# Altium schematic sheet 10_ethernet100.SchDoc
size C
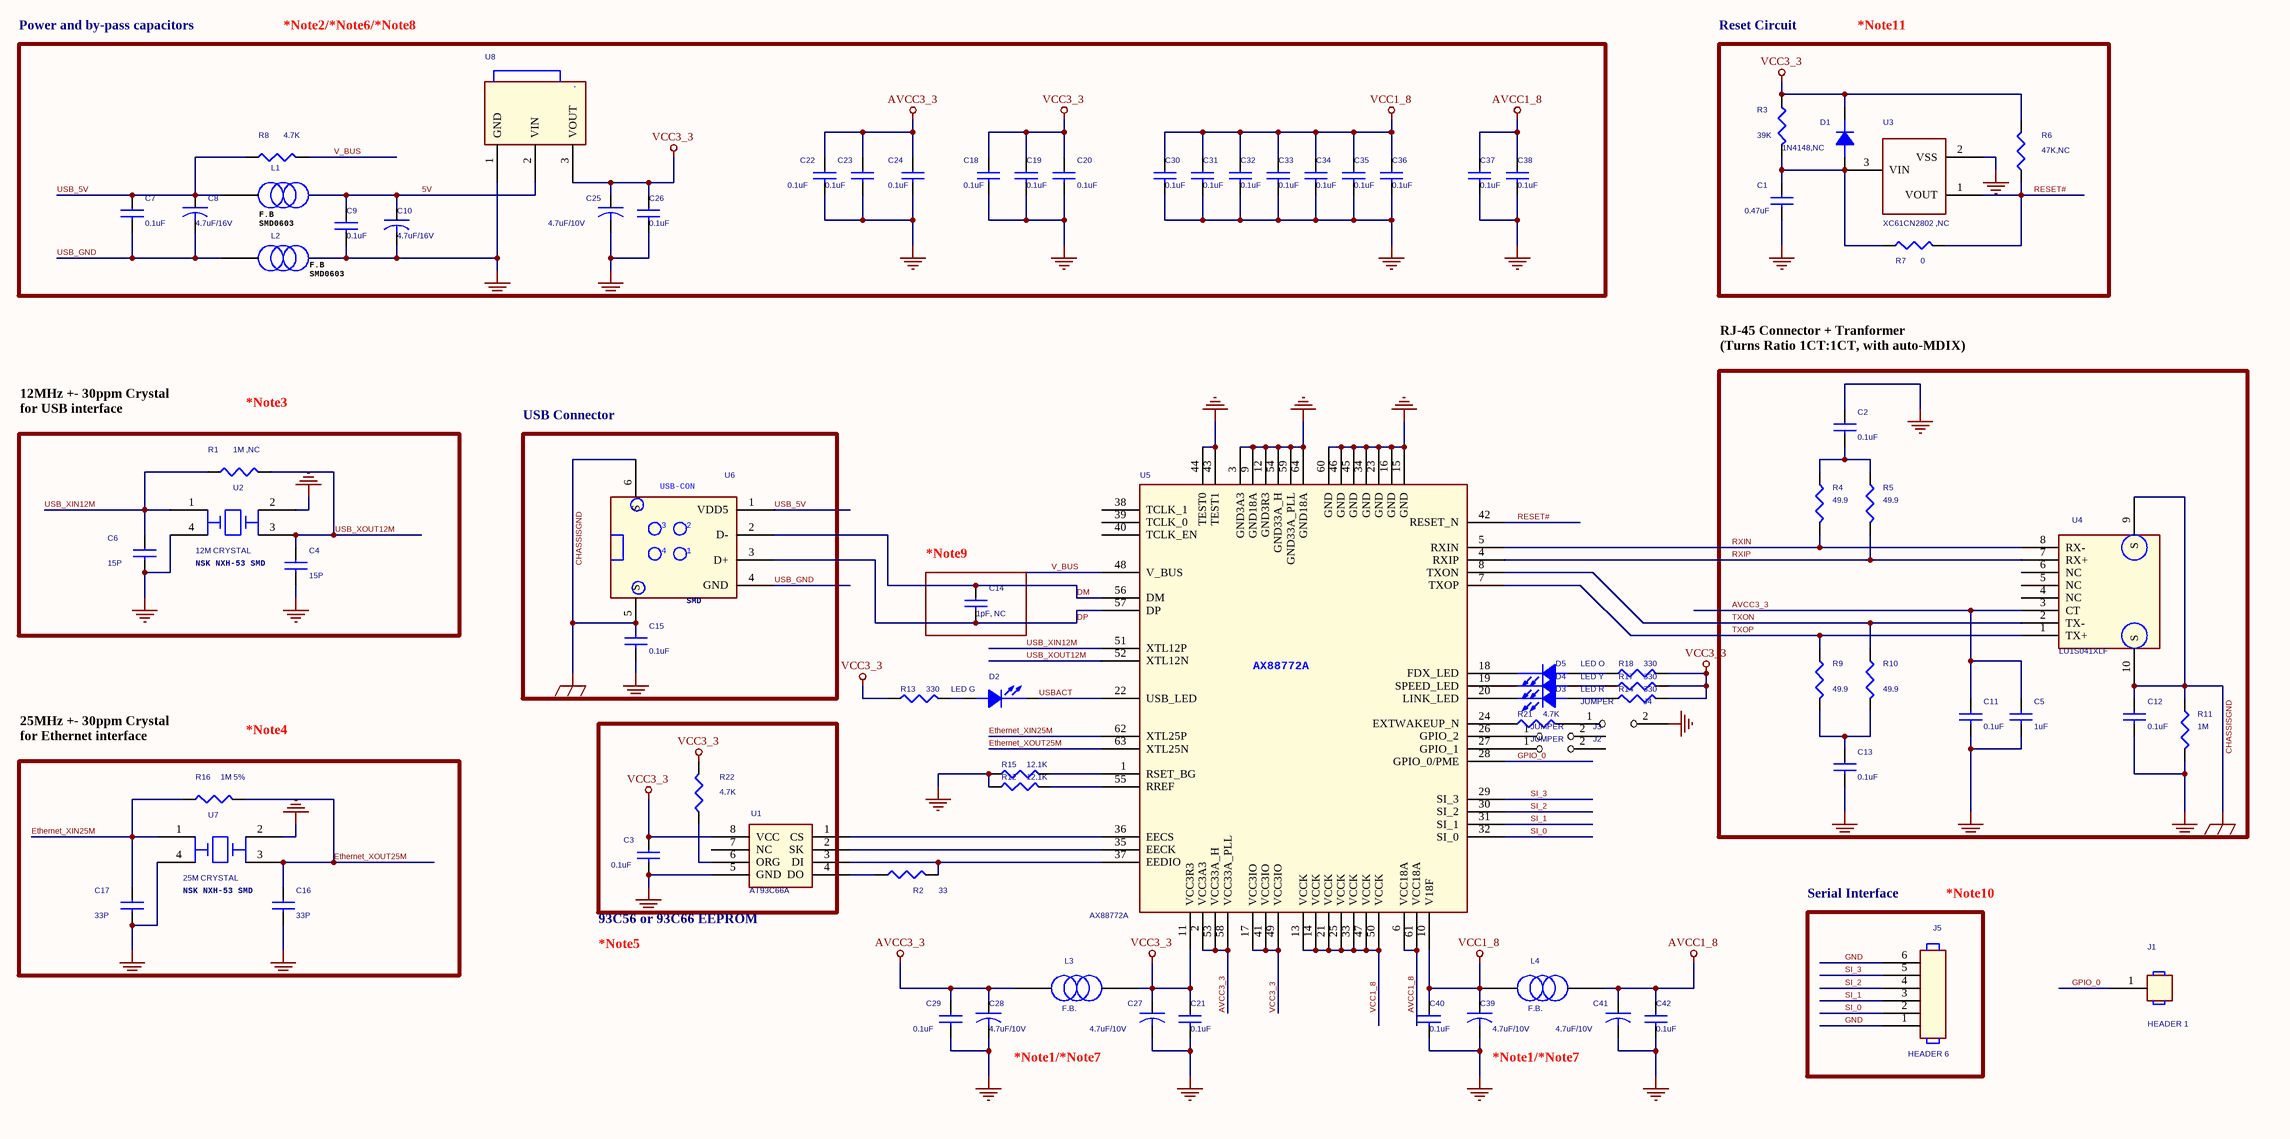
[diagram p0: 10_ethernet100.SchDoc]

## Parts
C1  0.47uF
C2  0.1uF  [C0603]
C3  0.1uF  [C0603]
C4  15P
C5  1uF  [C0603]
C6  15P
C7  0.1uF  [C0603]
C8  4.7uF/16V  [C0805]
C9  0.1uF  [C0603]
C10  4.7uF/16V  [C0805]
C11  0.1uF  [C0603]
C12  0.1uF  [C0603]
C13  0.1uF  [C0603]
C14  1pF, NC  [C0603]
C15  0.1uF  [C0603]
C16  33P
C17  33P
C18  0.1uF
C19  0.1uF
C20  0.1uF
C21  0.1uF
C22  0.1uF
C23  0.1uF
C24  0.1uF
C25  4.7uF/10V
C26  0.1uF
C27  4.7uF/10V
C28  4.7uF/10V
C29  0.1uF
C30  0.1uF
C31  0.1uF
C32  0.1uF
C33  0.1uF
C34  0.1uF
C35  0.1uF
C36  0.1uF
C37  0.1uF
C38  0.1uF
C39  4.7uF/10V
C40  0.1uF
C41  4.7uF/10V
C42  0.1uF
D1  1N4148,NC  [D1206]
D2  LED G
D3  LED R
D4  LED Y
D5  LED O
J1  HEADER 1
J2  JUMPER
J3  JUMPER
J4  JUMPER
J5  HEADER 6
L1  F.B.  (value not drawn)
L2  F.B.  (value not drawn)
L3  F.B.
L4  F.B.
R1  1M ,NC
R2  33  [R0603]
R3  39K
R4  49.9  [R0603]
R5  49.9  [R0603]
R6  47K,NC  [R0603]
R7  0
R8  4.7K  [R0603]
R9  49.9  [R0603]
R10  49.9  [R0603]
R11  1M  [R0603]
R12  12.1K
R13  330  [R0603]
R14  330  [R0603]
R15  12.1K
R16  1M 5%
R17  330  [R0603]
R18  330  [R0603]
R21  4.7K
R22  4.7K  [R0603]
U1  AT93C66A
U2  12M CRYSTAL
U3  XC61CN2802 ,NC
U4  LU1S041XLF
U5  AX88772A
U6  USB-CON  [QSP]  (value not drawn)
U7  25M CRYSTAL
U8  RT9161A-3.3V  (value not drawn)

## Blocks framed on the sheet
NSK NXH-53 SMD: C4 C6 R1 U2
USB Connector: C15 U6
*Note9: C14
NSK NXH-53 SMD: C16 C17 R16 U7

## Nets
AVCC1_8: C37.1 C38.1 C41.1 C42.1 L4.2 U5.6(VCC18A) U5.61(VCC18A)
AVCC3_3: C5.1 C11.1 C22.1 C23.1 C24.1 C28.1 C29.1 L3.1 U4.3(CT) U5.2(VCC3A3) U5.53(VCC33A_H) U5.58(VCC33A_PLL)
CHASSISGND: C12.1 C15.1 R11.1 U4.9(S) U4.10(S) U6.5(S) U6.6(S)
GND: C1.2 C2.1 C3.2 C4.2 C5.2 C6.2 C9.2 C10.2 C11.2 C12.2 C13.2 C15.2 C16.2 C17.2 C18.2 C19.2 C20.2 C21.2 C22.2 C23.2 C24.2 C25.2 C26.2 C27.2 C28.2 C29.2 C30.2 C31.2 C32.2 C33.2 C34.2 C35.2 C36.2 C37.2 C38.2 C39.2 C40.2 C41.2 C42.2 J4.2 J5.1 J5.6 L2.2 R11.2 R12.1 R15.1 U1.5(GND) U2.2 U2.4 U3.2(VSS) U5.3(GND3A3) U5.9(GND18A) U5.12(GND3R3) U5.15(GND) U5.16(GND) U5.23(GND) U5.34(GND) U5.43(TEST1) U5.44(TEST0) U5.45(GND) U5.46(GND) U5.54(GND33A_H) U5.59(GND33A_PLL) U5.60(GND) U5.64(GND18A) U7.2 U7.4 U8.1(GND)
VCC1_8: C30.1 C31.1 C32.1 C33.1 C34.1 C35.1 C36.1 C39.1 C40.1 L4.1 U5.10(V18F) U5.13(VCCK) U5.14(VCCK) U5.21(VCCK) U5.25(VCCK) U5.33(VCCK) U5.47(VCCK) U5.50(VCCK)
VCC3_3: C3.1 C18.1 C19.1 C20.1 C21.1 C25.1 C26.1 C27.1 D1.2(K) L3.2 R3.1 R6.2 R13.1 R14.2 R17.2 R18.2 R22.2 U1.8(VCC) U5.11(VCC3R3) U5.17(VCC3IO) U5.41(VCC3IO) U5.49(VCC3IO) U8.3(VOUT)
5V: C9.1 C10.1 L1.2 U8.2(VIN)
DM: C14.1 U5.56(DM) U6.2(D-)
DP: C14.2 U5.57(DP) U6.3(D+)
Ethernet_XIN25M: C17.1 R16.1 U5.62(XTL25P) U7.1
Ethernet_XOUT25M: C16.1 R16.2 U5.63(XTL25N) U7.3
GPIO_0: J1.1 U5.28(GPIO_0/PME)
RESET#: R6.1 R7.2 U3.1(VOUT) U5.42(RESET_N)
RXIN: R4.2 U4.8(RX-) U5.5(RXIN)
RXIP: R5.2 U4.7(RX+) U5.4(RXIP)
SI_0: J5.2 U5.32(SI_0)
SI_1: J5.3 U5.31(SI_1)
SI_2: J5.4 U5.30(SI_2)
SI_3: J5.5 U5.29(SI_3)
TXON: R10.1 U4.2(TX-) U5.8(TXON)
TXOP: R9.1 U4.1(TX+) U5.7(TXOP)
USB_5V: C7.1 C8.1 L1.1 R8.1 U6.1(VDD5)
USB_GND: C7.2 C8.2 L2.1 U6.4(GND)
USB_XIN12M: C6.1 R1.1 U2.1 U5.51(XTL12P)
USB_XOUT12M: C4.1 R1.2 U2.3 U5.52(XTL12N)
USBACT: D2.2(CATHODE) U5.22(USB_LED)
V_BUS: R8.2 U5.48(V_BUS)
NetC1_1: C1.1 D1.1(A) R3.2 R7.1 U3.3(VIN)
NetC2_2: C2.2 R4.1 R5.1
NetC13_1: C13.1 R9.2 R10.2
NetD2_1: D2.1(ANODE) R13.2
NetD3_1: D3.1(ANODE) R14.1
NetD3_2: D3.2(CATHODE) U5.20(LINK_LED)
NetD4_1: D4.1(ANODE) R17.1
NetD4_2: D4.2(CATHODE) U5.19(SPEED_LED)
NetD5_1: D5.1(ANODE) R18.1
NetD5_2: D5.2(CATHODE) U5.18(FDX_LED)
NetJ2_1: J2.1 U5.27(GPIO_1)
NetJ3_1: J3.1 U5.26(GPIO_2)
NetJ4_1: J4.1 R21.2
NetR2_1: R2.1 U1.4(DO)
NetR2_2: R2.2 U1.3(DI) U5.37(EEDIO)
NetR12_2: R12.2 U5.55(RREF)
NetR15_2: R15.2 U5.1(RSET_BG)
NetR21_1: R21.1 U5.24(EXTWAKEUP_N)
NetR22_1: R22.1 U1.6(ORG)
NetU1_1: U1.1(CS) U5.36(EECS)
NetU1_2: U1.2(SK) U5.35(EECK)

Not connected (* = marked no-connect by the designer): J2 2; J3 2; U1 7(NC); U4 4(NC) 5(NC) 6(NC); U5 38(TCLK_1) 39(TCLK_0) 40(TCLK_EN)

## Notes on the sheet
- Power and by-pass capacitors
- *Note2/*Note6/*Note8
- Reset Circuit
- *Note11
- F.B
  SMD0603
- (near L2) F.B
  SMD0603
- *Note3
- RJ-45 Connector + Tranformer
  (Turns Ratio 1CT:1CT, with auto-MDIX)
- (near R1) 12MHz +- 30ppm Crystal
  for USB interface
- (near U6) SMD
- *Note4
- (near R16) 25MHz +- 30ppm Crystal
  for Ethernet interface
- 93C56 or 93C66 EEPROM
- Serial Interface
- *Note10
- *Note5
- *Note1/*Note7

## Library data of the parts
C1 C4 C6 C7 C9 C16-C24 C26 C29-C38 C40 C42 = CAP NP_Dup2
C2 C5 C11-C15 = CAP NP_Dup1
C3 = CAP NP
C8 C10 = CAP
C25 C27 C28 C39 C41 = C
D1 = DIODE
D2-D5 = LED
L1-L4 = L
R1 R3-R5 R9-R12 R15 R16 R21 = R_Dup1
R2 R6-R8 R13 R14 R17 R18 = R
R22 = R_0
U1 = 93C56_2
U2 U7 = CRYSTAL4/SM
U3 = XC61G2802
U4 = LU1S041_1
U5 = AX88772A 60PIN SIMPLE_4
U6 = USB-CON_0